# EAGLE design ir_single (EAGLE 6.1)
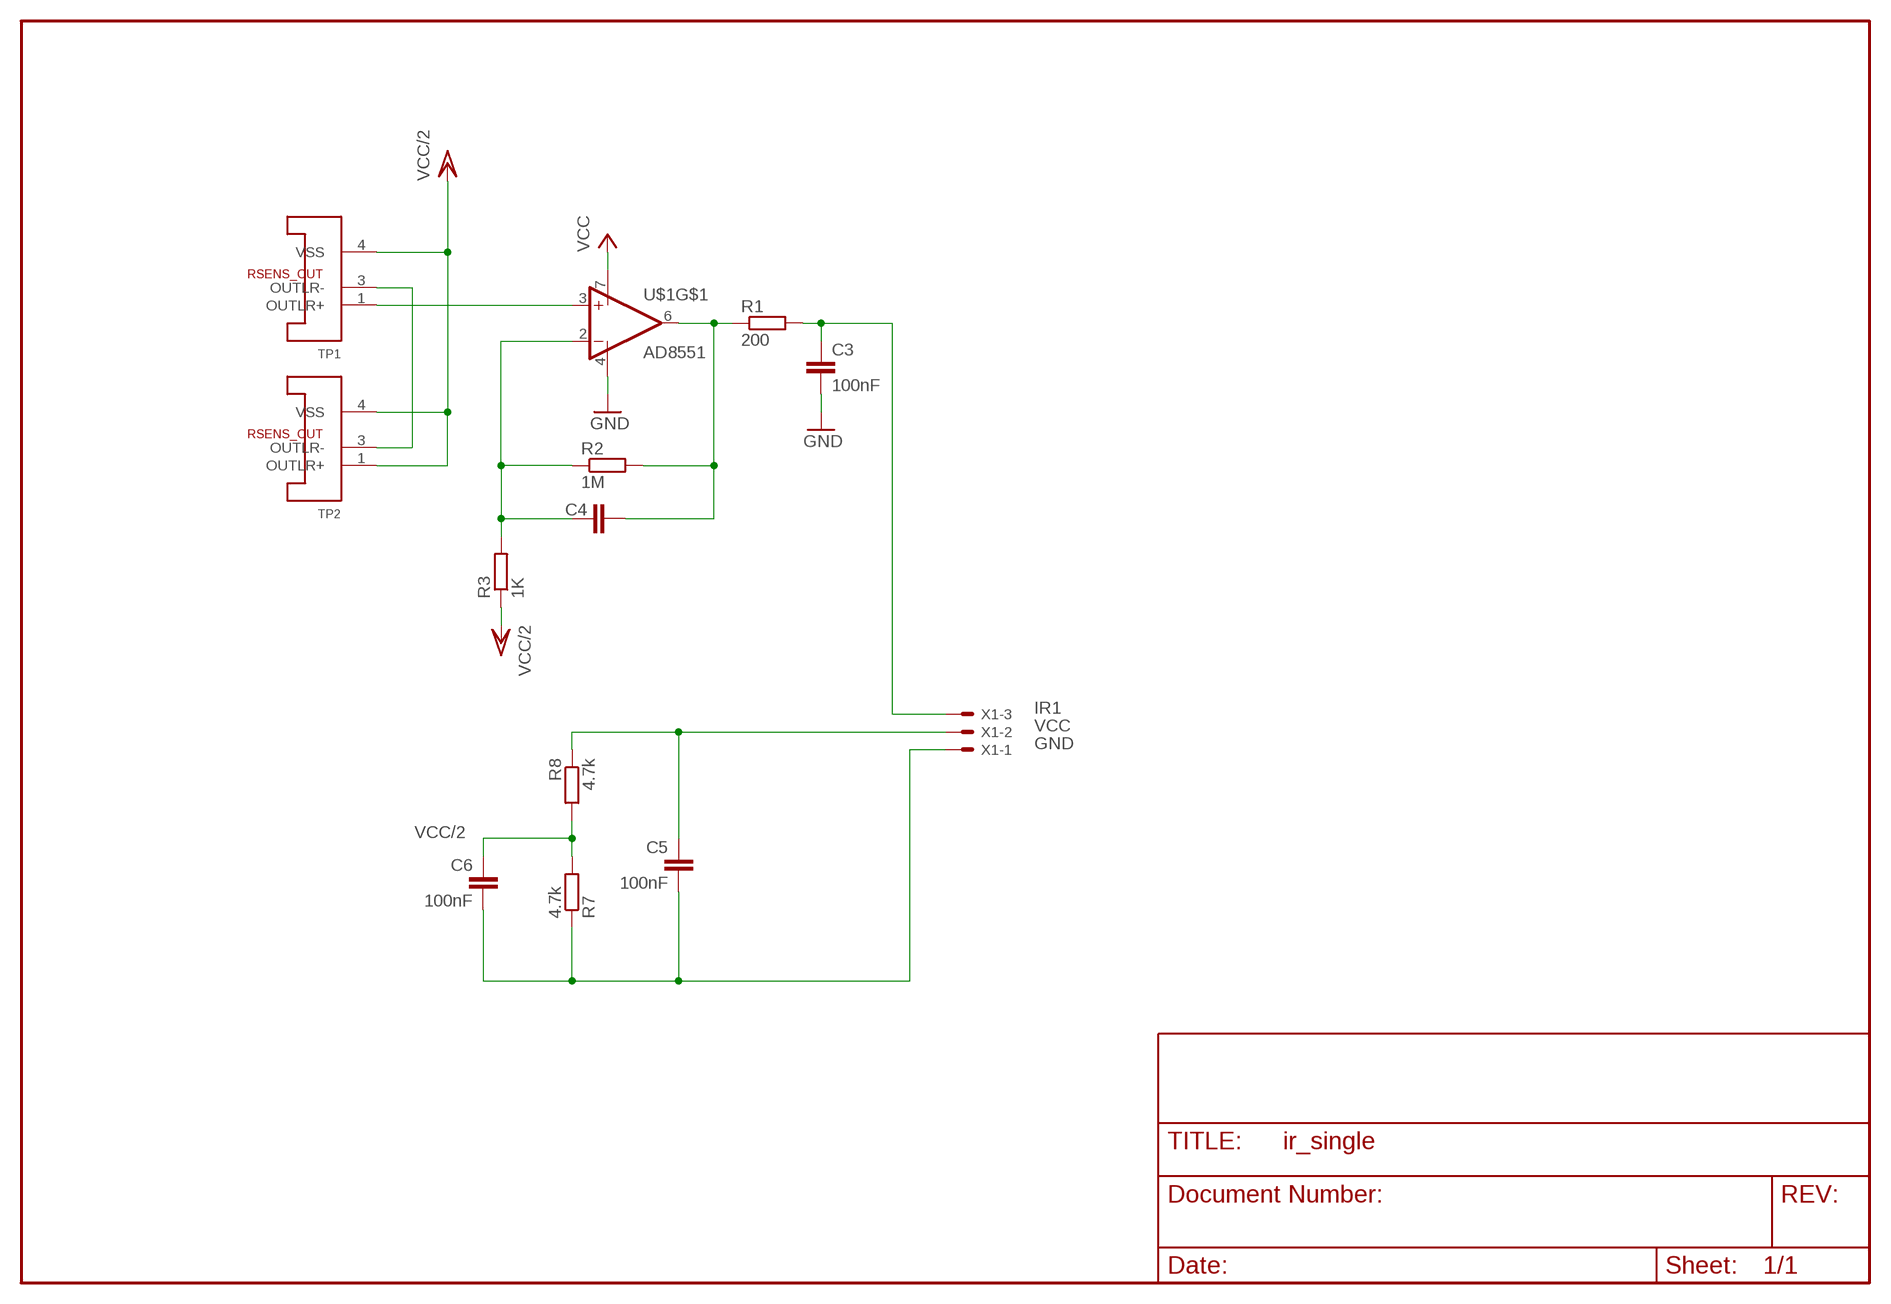
[diagram p0: schematic, sheet 1]

## Parts
C3  100nF  C-EUC0603  [C0603]
C4  C-EUC0603  [C0603]
C5  100nF  C-EUC0603  [C0603]
C6  100nF  C-EUC0603  [C0603]
R1  200  R-EU_R0603  [R0603]
R2  1M  R-EU_R0603  [R0603]
R3  1K  R-EU_R0603  [R0603]
R7  4.7k  R-EU_R0603  [R0603]
R8  4.7k  R-EU_R0603  [R0603]
TP1  MLX90247  [TO39H]
TP2  MLX90247  [TO39H]
U$1  AD8551  [MSOP8]
X1  53047-03  [53047-03]

## Nets
GND: C3.2 C5.2 C6.2 R7.1 U$1.4(V-) X1.1
IR1: C3.1 R1.2 X1.3
N$2: TP1.3(OUTLR-) TP2.3(OUTLR-)
N$8: C4.2 R1.1 R2.2 U$1.6(OUT)
N$11: TP1.1(OUTLR+) U$1.3(+IN)
N$125: C4.1 R2.1 R3.2 U$1.2(-IN)
VCC: C5.1 R8.1 U$1.7(V+) X1.2
VCC/2: C6.1 R3.1 R7.2 R8.2 TP1.4(VSS) TP2.1(OUTLR+) TP2.4(VSS)

## Library data of the parts
C3-C6 = rcl:C-EU: CAPACITOR, European symbol
R1-R3 R7 R8 = rcl:R-EU_: RESISTOR, European symbol
TP1 TP2 = paparazzi:MLX90247
U$1 = paparazzi:AD8551
X1 = con-molex:53?-03: CONNECTOR wire to board 1.25 mm (.049 inch) pitch header

## Board
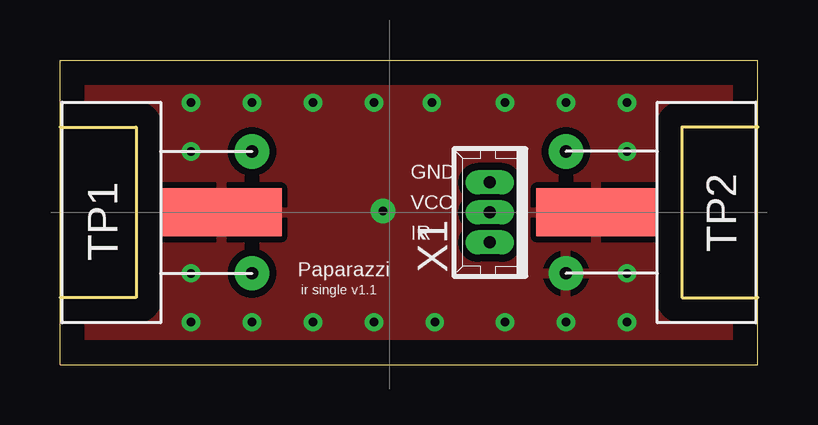
[diagram p1: board, top side]
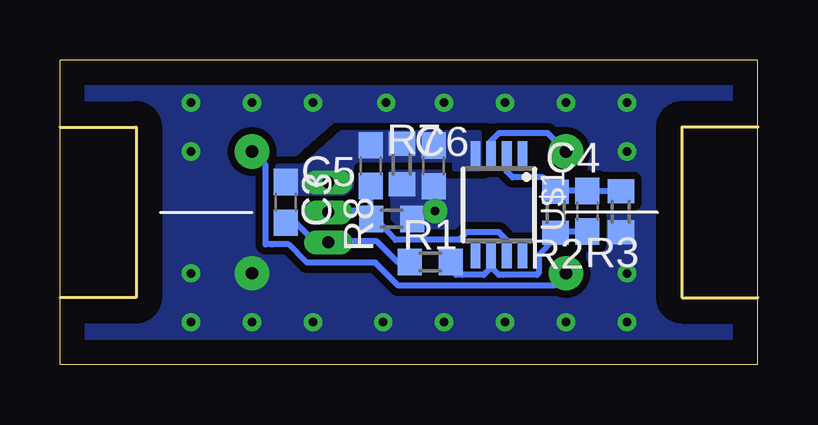
[diagram p2: board, bottom side, seen from below]

Size 29.08 x 12.7 mm. Coordinates in mm from the lower left corner, seen from the top.
Outline: 29.08,2.79 29.08,0 0,0 0,2.79
Outline: 29.08,2.79 29.08,9.91
Outline: 29.08,9.91 29.08,12.7 0,12.7 0,9.91
Outline: 29.08,9.91 25.91,9.91 25.91,2.79 29.08,2.79
Outline: 0,9.91 3.17,9.91 3.17,2.79 0,2.79
Outline: 0,2.79 0,9.91
Copper layers (1*16): Top 0.035mm / dielectric 1.5mm / Bottom 0.035mm
Design rules: minimum track width 6mil, minimum drill 12mil, track to track 6mil, track to pad 6mil, pad to pad 6mil, via to via 6mil, smd to smd 6mil, copper to edge 40mil, drill to drill 8mil, minimum pad ring 10mil, minimum via ring 8mil, stop-mask expansion 4mil, vias tented up to drill 0mil, thermal gap 10mil

### Footprints (pad centres in the part's own frame; a part is rotated, then mirrored left to right if it is on the bottom)
C0603 = smd 1.1 x 1: 1 -0.85,0; 2 0.85,0
R0603 = smd 1 x 1.1: 1 -0.85,0; 2 0.85,0
TO39H = drill 0.508 pad 1.422: 1 2.54,-3.81; 3 -2.54,-3.81 | smd 2 x 5: 4 0,-2.54
MSOP8 = smd 0.4 x 1.2: 1 -0.975,-2.05; 2 -0.325,-2.05; 3 0.325,-2.05; 4 0.975,-2.05; 5 0.975,2.05; 6 0.325,2.05; 7 -0.325,2.05; 8 -0.975,2.05
53047-03 = drill 0.5 pad 0.698 long: 1 1.25,0; 2 0,0; 3 -1.25,0

### Placement (x,y rotation side)
C3  19.67,6.77 90 bottom
C4  7.11,6.4 270 bottom
C5  16.13,8.3 90 bottom
C6  13.51,8.29 90 bottom
R1  13.66,4.28 180 bottom
R2  8.43,6.36 270 bottom
R3  5.71,6.37 90 bottom
R7  14.84,8.36 270 bottom
R8  15.26,6.08 0 bottom
TP1  4.19,6.35 90 top
TP2  24.89,6.35 270 top
U$1  10.79,6.67 180 bottom
X1  17.91,6.35 90 top

### Tracks (layer width: path | path; a pad name or v marks a point on that pad's centre or on a via)
GND
  pour Bottom (no thermals): 11.62,8.19 11.62,9.65 17.34,9.65 18.92,8.26 20,8.26 20,7.18 17.21,7.18 16.95,7.43 16.95,8.32 16.76,8.57 12.64,8.57 12.64,8.19
IR1
  Bottom 0.254: 19.67,6.33 19.68,6.35 | 19.67,6.33 C3.1 | 19.67,6.33 18.45,5.11 X1.3 | R1.2 15.01,4.28 15.88,5.14 17.91,5.14 X1.3 | X1.3 17.91,5.08
N$2
  Bottom 0.254: TP2.3 20.51,8.32 20.51,6.29 20.51,5.02 20.26,5.02 19.56,5.02 18.8,4.25 17.59,4.25 15.94,4.25 14.99,3.3 11.11,3.3 8.51,3.3 TP1.3
N$8
  Bottom 0.254: R2.2 8.43,5.47 8.48,5.43 | 8.54,5.37 8.48,5.43 | 11.11,4.06 10.79,3.75 10.6,3.75 9.21,3.75 9.14,3.81 9.14,4.57 8.51,5.21 8.51,5.46 | U$1.6 11.11,4.64 11.11,4.06 | 11.11,4.06 11.43,3.75 12.32,3.75 12.57,3.75 12.57,4.25 12.56,4.27 R1.1 | 8.54,5.37 8.64,5.46 8.55,5.55 C4.2 | 8.54,5.37 | 8.51,5.46 | 8.48,5.43 8.51,5.46
N$11
  Bottom 0.254: TP1.1 8.76,9.65 10.54,9.65 10.79,9.65 11.18,9.27 11.18,8.76 U$1.3
N$125
  Bottom 0.254: U$1.2 10.47,8.71 10.48,8.7 10.48,8.06 10.22,7.81 9.65,7.81 8.95,7.81 8.45,7.3 8.43,7.29 R2.1 8.41,7.21 8.38,7.24 8.38,7.25 C4.1 7.23,7.25 7.24,7.24 7.22,7.22 R3.2
VCC
  Bottom 0.254: U$1.7 10.47,5.2 10.79,5.52 12.13,5.52 12.45,5.21 15.11,5.21 16,6.16 16.08,6.08 R8.1 | 16.13,6.1 R8.1 | 16.13,6.1 16.13,6.09 R8.1 | C5.1 16.13,6.1 | 17.96,6.41 17.97,6.41 | 16.13,6.1 16.45,6.41 17.96,6.41 | 17.96,6.41 17.91,6.41 X1.2
VCC/2  (via drill 0.35, 0.35 pad 1.02)
  other vias: 23.62,1.78 13.46,6.41 8,1.78 21.08,1.78 5.46,1.78 18.54,1.78 23.62,10.92 21.08,10.92 18.54,10.92 5.46,10.92 8,10.92 23.62,8.89 23.62,3.81 5.46,8.89 5.46,3.81 10.54,10.92 13.08,10.92 15.49,10.92 10.54,1.78 13.08,1.78 15.62,1.78
  pour Top (isolate 0.305): 1.02,12.7 28.07,12.7 28.07,0 1.02,0
  pour Bottom (isolate 0.305, rank 2, no thermals): 1.02,12.7 28.07,12.7 28.07,0 1.02,0

### Text on the board
tNames: GND | VCC | IR | Paparazzi | ir single v1.1